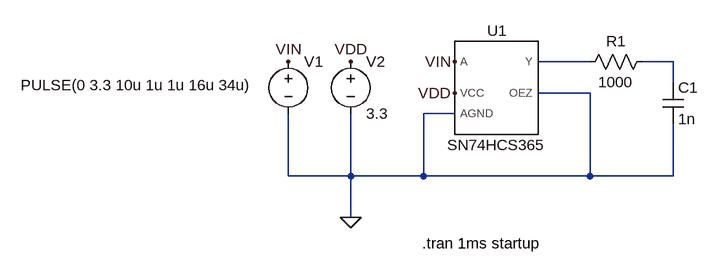
[diagram p0: schematic buffer.asc]
buffer.asc, the LTspice schematic file:
Version 4
SHEET 1 880 680
WIRE 224 32 144 32
WIRE 352 32 304 32
WIRE 352 64 352 32
WIRE 224 80 144 80
WIRE 16 112 -32 112
WIRE -240 208 -240 112
WIRE -144 208 -144 112
WIRE -144 208 -240 208
WIRE -32 208 -32 112
WIRE -32 208 -144 208
WIRE 224 208 224 80
WIRE 224 208 -32 208
WIRE 352 208 352 128
WIRE 352 208 224 208
WIRE -144 272 -144 208
FLAG -144 272 0
FLAG -144 32 VDD
FLAG -240 32 VIN
FLAG 16 80 VDD
FLAG 16 32 VIN
SYMBOL voltage -240 16 R0
WINDOW 3 -54 52 Right 2
WINDOW 123 0 0 Left 0
WINDOW 39 0 0 Left 0
SYMATTR InstName V1
SYMATTR Value PULSE(0 3.3 10u 1u 1u 16u 34u)
SYMBOL SN74HCS365 64 64 R0
SYMATTR InstName U1
SYMBOL voltage -144 16 R0
WINDOW 123 0 0 Left 0
WINDOW 39 0 0 Left 0
SYMATTR InstName V2
SYMATTR Value 3.3
SYMBOL cap 336 64 R0
SYMATTR InstName C1
SYMATTR Value 1n
SYMBOL res 208 48 R270
WINDOW 0 32 56 VTop 2
WINDOW 3 0 56 VBottom 2
SYMATTR InstName R1
SYMATTR Value 1000
TEXT -34 312 Left 2 !.tran 1ms startup

The netlist it stands for:
* buffer.asc
V1 VIN 0 PULSE(0 3.3 10u 1u 1u 16u 34u)
XU1 N001 VIN 0 VDD 0 SN74HCS365  ; pins Y A OEZ VCC AGND
V2 VDD 0 3.3
C1 N002 0 1n
R1 N001 N002 1000
.tran 1ms startup
.lib .\SN74HCS365.cir
.backanno
.end